# Altium schematic sheet WIFIBT_AP6398S.SchDoc
size A3; SheetNumber: 17; SheetTotal: 22
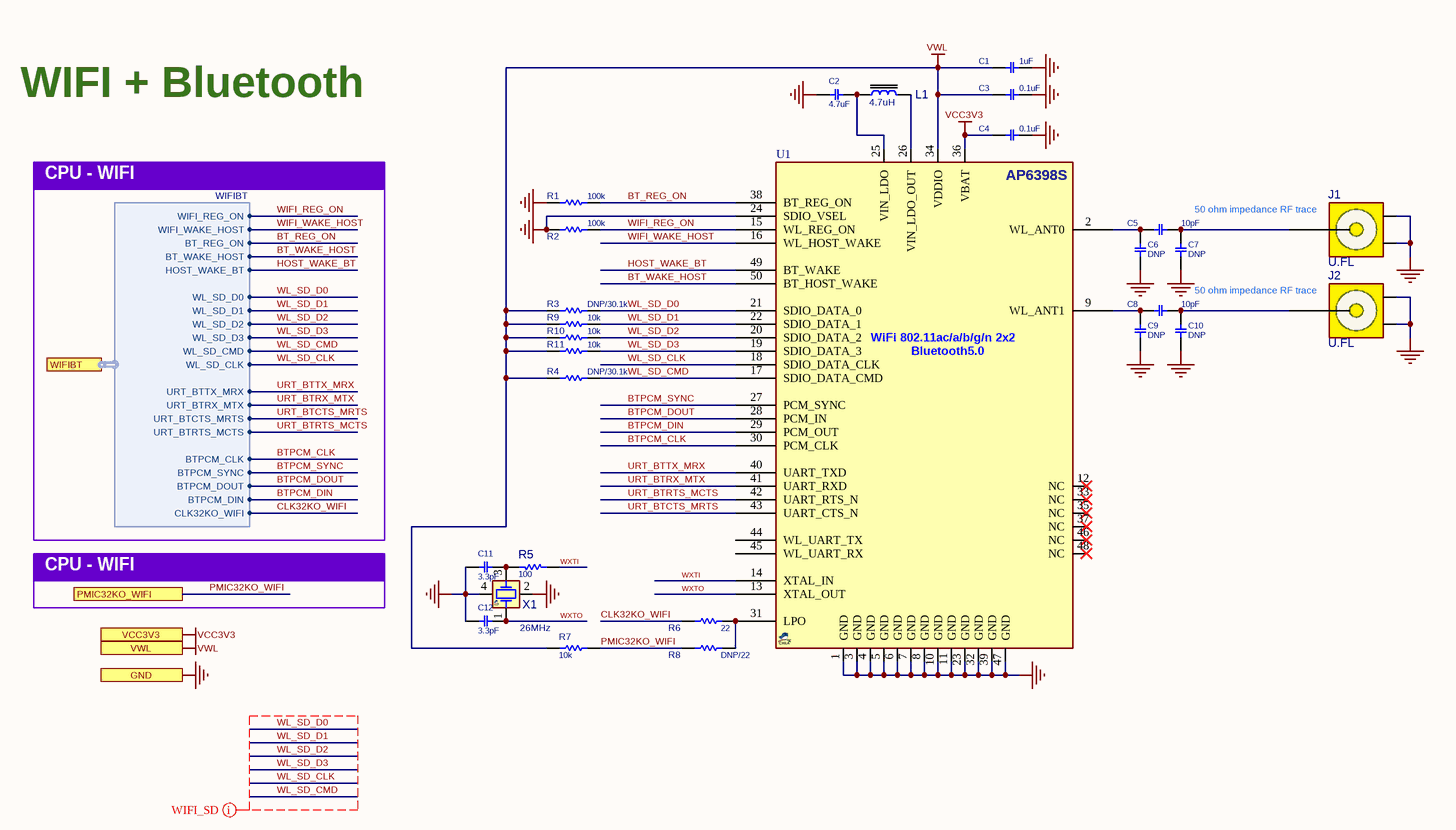
[diagram p0: WIFIBT_AP6398S.SchDoc]

## Parts
C1  1uF  [C0402]
C2  4.7uF  [C0402]
C3  0.1uF  [C0402]
C4  0.1uF  [C0402]
C5  10pF  [C0402]
C6  DNP  [C0402]
C7  DNP  [C0402]
C8  10pF  [C0402]
C9  DNP  [C0402]
C10  DNP  [C0402]
C11  3.3pF  [C0402]
C12  3.3pF  [C0402]
J1  U.FL  [UFL]
J2  U.FL  [UFL]
L1  4.7uH  [L_3]
R1  100k  [R0402]
R2  100k  [R0402]
R3  DNP/30.1k  [R0402]
R4  DNP/30.1k  [R0402]
R5  100  [R0402]
R6  22  [R0402]
R7  10k  [R0402]
R8  DNP/22  [R0402]
R9  10k  [R0402]
R10  10k  [R0402]
R11  10k  [R0402]
U1  AP6398S  [AP6398S_50]  (value not drawn)
X1  26MHz  [XTL_4_2016]

## Ports
GND, PMIC32KO_WIFI, VCC3V3, VWL, WIFIBT (harness WIFIBT)

## Harnesses
WIFIBT: WIFI_REG_ON, WIFI_WAKE_HOST, BT_REG_ON, BT_WAKE_HOST, HOST_WAKE_BT, WL_SD_D0, WL_SD_D1, WL_SD_D2, WL_SD_D3, WL_SD_CMD, WL_SD_CLK, URT_BTTX_MRX, URT_BTRX_MTX, URT_BTCTS_MRTS, URT_BTRTS_MCTS, BTPCM_CLK, BTPCM_SYNC, BTPCM_DOUT, BTPCM_DIN, CLK32KO_WIFI

## Nets
GND: C1.1 C2.2 C3.1 C4.1 C6.2 C7.2 C9.2 C10.2 C11.2 C12.2 J1.2(G1) J1.3(G2) J2.2(G1) J2.3(G2) R1.2 R2.2 U1.1(GND) U1.3(GND) U1.4(GND) U1.5(GND) U1.6(GND) U1.7(GND) U1.8(GND) U1.10(GND) U1.11(GND) U1.23(GND) U1.24(SDIO_VSEL) U1.32(GND) U1.39(GND) U1.47(GND) X1.2(GND1) X1.4(GND2) ; port GND
VCC3V3: C4.2 U1.36(VBAT) ; port VCC3V3
VWL: C1.2 C3.2 R3.2 R4.2 R7.1 R9.2 R10.2 R11.2 U1.34(VDDIO) ; port VWL
BT_REG_ON: R1.1 U1.38(BT_REG_ON) ; port WIFIBT.BT_REG_ON
BT_WAKE_HOST: U1.50(BT_HOST_WAKE) ; port WIFIBT.BT_WAKE_HOST
BTPCM_CLK: U1.30(PCM_CLK) ; port WIFIBT.BTPCM_CLK
BTPCM_DIN: U1.29(PCM_OUT) ; port WIFIBT.BTPCM_DIN
BTPCM_DOUT: U1.28(PCM_IN) ; port WIFIBT.BTPCM_DOUT
BTPCM_SYNC: U1.27(PCM_SYNC) ; port WIFIBT.BTPCM_SYNC
CLK32KO_WIFI: R6.2 ; port WIFIBT.CLK32KO_WIFI
HOST_WAKE_BT: U1.49(BT_WAKE) ; port WIFIBT.HOST_WAKE_BT
PMIC32KO_WIFI: R7.2 R8.2 ; port PMIC32KO_WIFI
URT_BTCTS_MRTS: U1.43(UART_CTS_N) ; port WIFIBT.URT_BTCTS_MRTS
URT_BTRTS_MCTS: U1.42(UART_RTS_N) ; port WIFIBT.URT_BTRTS_MCTS
URT_BTRX_MTX: U1.41(UART_RXD) ; port WIFIBT.URT_BTRX_MTX
URT_BTTX_MRX: U1.40(UART_TXD) ; port WIFIBT.URT_BTTX_MRX
WIFI_REG_ON: R2.1 U1.15(WL_REG_ON) ; port WIFIBT.WIFI_REG_ON
WIFI_WAKE_HOST: U1.16(WL_HOST_WAKE) ; port WIFIBT.WIFI_WAKE_HOST
WL_SD_CLK: U1.18(SDIO_DATA_CLK) ; port WIFIBT.WL_SD_CLK
WL_SD_CMD: R4.1 U1.17(SDIO_DATA_CMD) ; port WIFIBT.WL_SD_CMD
WL_SD_D0: R3.1 U1.21(SDIO_DATA_0) ; port WIFIBT.WL_SD_D0
WL_SD_D1: R9.1 U1.22(SDIO_DATA_1) ; port WIFIBT.WL_SD_D1
WL_SD_D2: R10.1 U1.20(SDIO_DATA_2) ; port WIFIBT.WL_SD_D2
WL_SD_D3: R11.1 U1.19(SDIO_DATA_3) ; port WIFIBT.WL_SD_D3
WXTI: R5.2 U1.14(XTAL_IN)
WXTO: C12.1 U1.13(XTAL_OUT) X1.1(XA)
NetC2_1: C2.1 L1.1 U1.25(VIN_LDO)
NetC5_1: C5.1 C7.1 J1.1(SIG)
NetC5_2: C5.2 C6.1 U1.2(WL_ANT0)
NetC8_1: C8.1 C10.1 J2.1(SIG)
NetC8_2: C8.2 C9.1 U1.9(WL_ANT1)
NetC11_1: C11.1 R5.1 X1.3(XB)
NetL1_2: L1.2 U1.26(VIN_LDO_OUT)
NetR6_1: R6.1 R8.1 U1.31(LPO)

Not connected (* = marked no-connect by the designer): U1 12(NC)* 33(NC)* 35(NC)* 37(NC)* 44(WL_UART_TX) 45(WL_UART_RX) 46(NC)* 48(NC)*

## Layout directives
net class WIFI_SD: WL_SD_CLK, WL_SD_CMD, WL_SD_D0, WL_SD_D1, WL_SD_D2, WL_SD_D3

## Notes on the sheet
- WIFI + Bluetooth
- CPU - WIFI
- (near J1) 50 ohm impedance RF trace
- (near J2) 50 ohm impedance RF trace
- (in symbol AP6398S) WiFi 802.11ac/a/b/g/n 2x2; Bluetooth5.0

## Library data of the parts
C1 = CAP_SMD_MLCC: CAP, MLCC; PARAM: X5R, 10%; MANF_P#: CL05A105KO5NNND; MANF: Samsung; PARAM2: 16v; PRICE: 50,000:	$0.006; ASSEMBLY: ASSEMBLY; VALUE: 1uF
C2 = CAP_SMD_MLCC: CAP, MLCC; PARAM: X5R, 20%; MANF_P#: LMK105BBJ475MVLF; MANF: Taiyo Yuden; PARAM2: 10v; PRICE: 10,000: $0.034; ASSEMBLY: ASSEMBLY; VALUE: 4.7uF
C3 C4 = CAP_SMD_MLCC: CAP, MLCC; PARAM: X5R, 10%; MANF_P#: GRM155R61E104; MANF: Murata; PARAM2: 25v; PRICE: 10,000:$0.006; ASSEMBLY: ASSEMBLY; VALUE: 0.1uF
C5 C8 = CAP_SMD_MLCC: CAP, MLCC; PARAM: C0G, 10%; DESC: CAP, MLCC, 1nF, 50V, C0G, 10%, 0402; MANF_P#: CC0402JRNPO9BN100; MANF: YAGEO; PARAM2: 50V; PRICE: 100= $0.012; ASSEMBLY: ASSEMBLY; VALUE: 10pF
C6 C7 C9 C10 = CAP_SMD_MLCC: CAP, MLCC, 1nF, 50V, C0G, 10%, 0402; PARAM: C0G, 10%; PRICE: 100= 1$; DESC: CAP, MLCC, 1nF, 50V, C0G, 10%, 0402; MANF_P#: -; MANF: -; PARAM2: 50V; ASSEMBLY: ASSEMBLY; VALUE: DNP
C11 C12 = CAP_SMD_MLCC: CAP, MLCC; PARAM: C0G, 10%; MANF_P#: CC0402CRNPO9BN3R3; MANF: Yageo; PARAM2: 50V; PRICE: 100: 0.009$; DESC: CAP, MLCC; ASSEMBLY: ASSEMBLY; VALUE: 3.3pF
J1 J2 = CONN_RF_UFL: CONN, RF, U.FL, STRAIGHT, Ultra Miniature Coaxial; MANF_P#: CONUFL001-SMD, U.FL-R-SMT-1(10), 128-0711-201; MANF: Linx, Hirose, Cinch; PARAM: 50Ohm, 6GHz; DESC: DESCRIPTION; DIST#: DIGIKEY, MOUSER; PARAM2: GOLD; ASSEMBLY: ASSEMBLY; PRICE: 0.9$; VALUE: U.FL
L1 = INDPWR_SMD: INDUCTOR, POWER, SMD; MANF: Bourns; MANF_P#: SRN3010-4R7M; PARAM2: 20%, 150mOhm; PARAM: 1A; VALUE: 4.7uH
R1-R11 = RES_SMD: RESISTOR, SMD; PARAM: 0.063W; DESC: DESCRIPTION; DIST#: MOUSER; PARAM2: 1%; MANF_P#: -; MANF: -; ASSEMBLY: ASSEMBLY; PRICE: 100= 0.3$
  R1 R2: VALUE: 100k
  R3 R4: VALUE: DNP/30.1k
  R5: VALUE: 100
  R6: VALUE: 22
  R7 R9-R11: VALUE: 10k
  R8: VALUE: DNP/22
U1 = AP6398S: WiFi with Bluetooth 5.0,; MANF: AMPAK; PARAM2: 3.2~3.8V; PARAM: IEEE 802.11ac/a/b/g/n 2x2; MANF_P#: AP6398S; VALUE: AP6398S
X1 = XTL_4_40MHz_3225F: CRYSTAL; MANF: Murata; PARAM: 20PPM, -30~85oC; PARAM2: 6pF, 150OhmESR; MANF_P#: XRCGB26M000F2P00R0; ASSEMBLY: ASSEMBLY; PRICE: 1,000: $0.2; VALUE: 26MHz